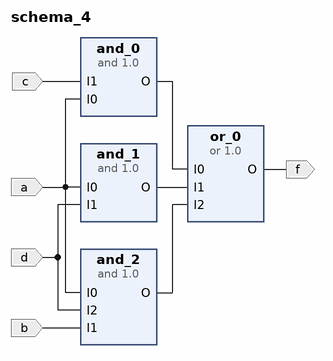
[diagram p0: block diagram of the top level]
# Vivado block design schema_4, xc7a35tcpg236-1, Vivado 2018.2
create_bd_design schema_4

create_bd_port -dir I a
create_bd_port -dir I b
create_bd_port -dir I c
create_bd_port -dir I d
create_bd_port -dir O f

create_bd_cell -type ip -vlnv FIT:user:and:1.0 and_0
set_property -dict {CONFIG.I0_Inverted true CONFIG.I1_inverted true} [get_bd_cells and_0]
create_bd_cell -type ip -vlnv FIT:user:and:1.0 and_1
set_property -dict {CONFIG.I0_Inverted true} [get_bd_cells and_1]
create_bd_cell -type ip -vlnv FIT:user:and:1.0 and_2
set_property -dict {CONFIG.Inputs 3 CONFIG.I2_inverted true} [get_bd_cells and_2]
create_bd_cell -type ip -vlnv FIT:user:or:1.0 or_0
set_property -dict {CONFIG.Inputs 3} [get_bd_cells or_0]

# ---- connections ----

connect_bd_net [get_bd_ports a] [get_bd_pins and_0/I0] [get_bd_pins and_1/I0] [get_bd_pins and_2/I0]
connect_bd_net [get_bd_ports c] [get_bd_pins and_0/I1]
connect_bd_net [get_bd_ports d] [get_bd_pins and_1/I1] [get_bd_pins and_2/I2]
connect_bd_net [get_bd_ports b] [get_bd_pins and_2/I1]
connect_bd_net [get_bd_pins and_0/O] [get_bd_pins or_0/I0]
connect_bd_net [get_bd_pins and_1/O] [get_bd_pins or_0/I1]
connect_bd_net [get_bd_pins and_2/O] [get_bd_pins or_0/I2]
connect_bd_net [get_bd_pins or_0/O] [get_bd_ports f]

validate_bd_design
save_bd_design
